# Altium schematic sheet Sheet1.SchDoc
size A4; SheetNumber: 1; SheetTotal: 1
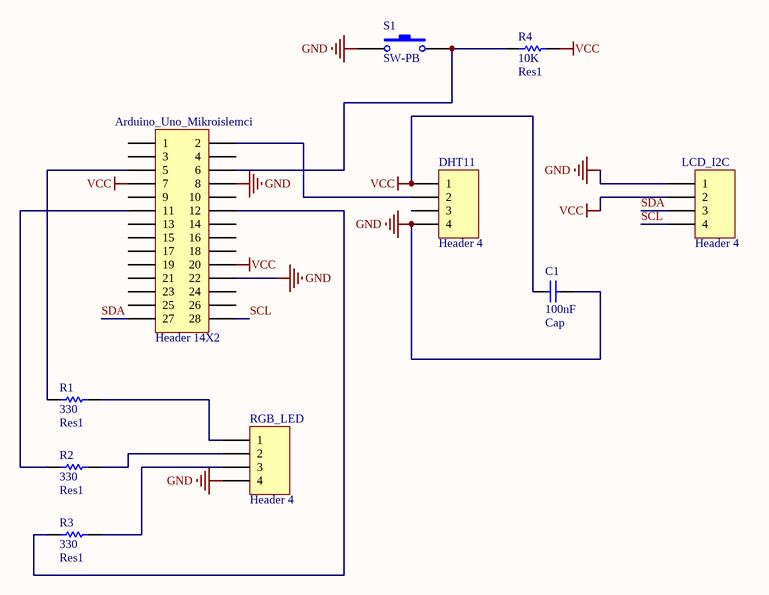
[diagram p0: Sheet1.SchDoc]

## Parts
Arduino_Uno_Mikroislemci  Header 14X2  [HDR2X14]
C1  Cap  value 100nF  [RAD-0.3]
DHT11  Header 4  [HDR1X4]
LCD_I2C  Header 4  [HDR1X4]
R1  Res1  value 330  [AXIAL-0.3]
R2  Res1  value 330  [AXIAL-0.3]
R3  Res1  value 330  [AXIAL-0.3]
R4  Res1  value 10K  [AXIAL-0.3]
RGB_LED  Header 4  [HDR1X4]
S1  SW-PB  [SPST-2]

## Nets
GND: Arduino_Uno_Mikroislemci.8 Arduino_Uno_Mikroislemci.22 C1.2 DHT11.4 LCD_I2C.1 RGB_LED.4 S1.1
VCC: Arduino_Uno_Mikroislemci.7 Arduino_Uno_Mikroislemci.20 C1.1 DHT11.1 LCD_I2C.2 R4.2
SCL: Arduino_Uno_Mikroislemci.28 LCD_I2C.4
SDA: Arduino_Uno_Mikroislemci.27 LCD_I2C.3
NetArduino_Uno_Mikroislemci_2: Arduino_Uno_Mikroislemci.2 DHT11.2
NetArduino_Uno_Mikroislemci_5: Arduino_Uno_Mikroislemci.5 R1.1
NetArduino_Uno_Mikroislemci_6: Arduino_Uno_Mikroislemci.6 R4.1 S1.2
NetArduino_Uno_Mikroislemci_11: Arduino_Uno_Mikroislemci.11 R2.1
NetArduino_Uno_Mikroislemci_12: Arduino_Uno_Mikroislemci.12 R3.1
NetR1_2: R1.2 RGB_LED.1
NetR2_2: R2.2 RGB_LED.2
NetR3_2: R3.2 RGB_LED.3

Not connected (* = marked no-connect by the designer): Arduino_Uno_Mikroislemci 1 3 4 9 10 13 14 15 16 17 18 19 21 23 24 25 26; DHT11 3

## Library data of the parts
Arduino_Uno_Mikroislemci = Header 14X2: Header, 14-Pin, Dual row; LatestRevisionDate: 17-Jul-2002; LatestRevisionNote: Re-released for DXP Platform.; Publisher: Altium Limited
C1 = Cap: Capacitor; Published: 8-Jun-2000; LatestRevisionDate: 17-Jul-2002; LatestRevisionNote: Re-released for DXP Platform.; PackageReference: RAD-0.3; Publisher: Altium Limited; PackageDescription: Radial Cap, Thru-Hole; 2 Leads; 0.3 in Pin Spacing
DHT11 LCD_I2C RGB_LED = Header 4: Header, 4-Pin; LatestRevisionDate: 17-Jul-2002; LatestRevisionNote: Re-released for DXP Platform.; Publisher: Altium Limited
R1-R4 = Res1: Resistor; Published: 8-Jun-2000; LatestRevisionDate: 17-Jul-2002; LatestRevisionNote: Re-released for DXP Platform.; PackageReference: AXIAL-0.3; Publisher: Altium Limited; PackageDescription: Axial Device, Thru-Hole; 2 Leads; 0.3 in Pin Spacing
S1 = SW-PB: Switch; Published: 24-Mar-1999; LatestRevisionDate: 17-Jul-2002; LatestRevisionNote: Re-released for DXP Platform.; PackageReference: SPST-2; Publisher: Altium Limited; PackageDescription: Switch; 2 Leads